# EAGLE board SOC_camera (EAGLE 6.2)
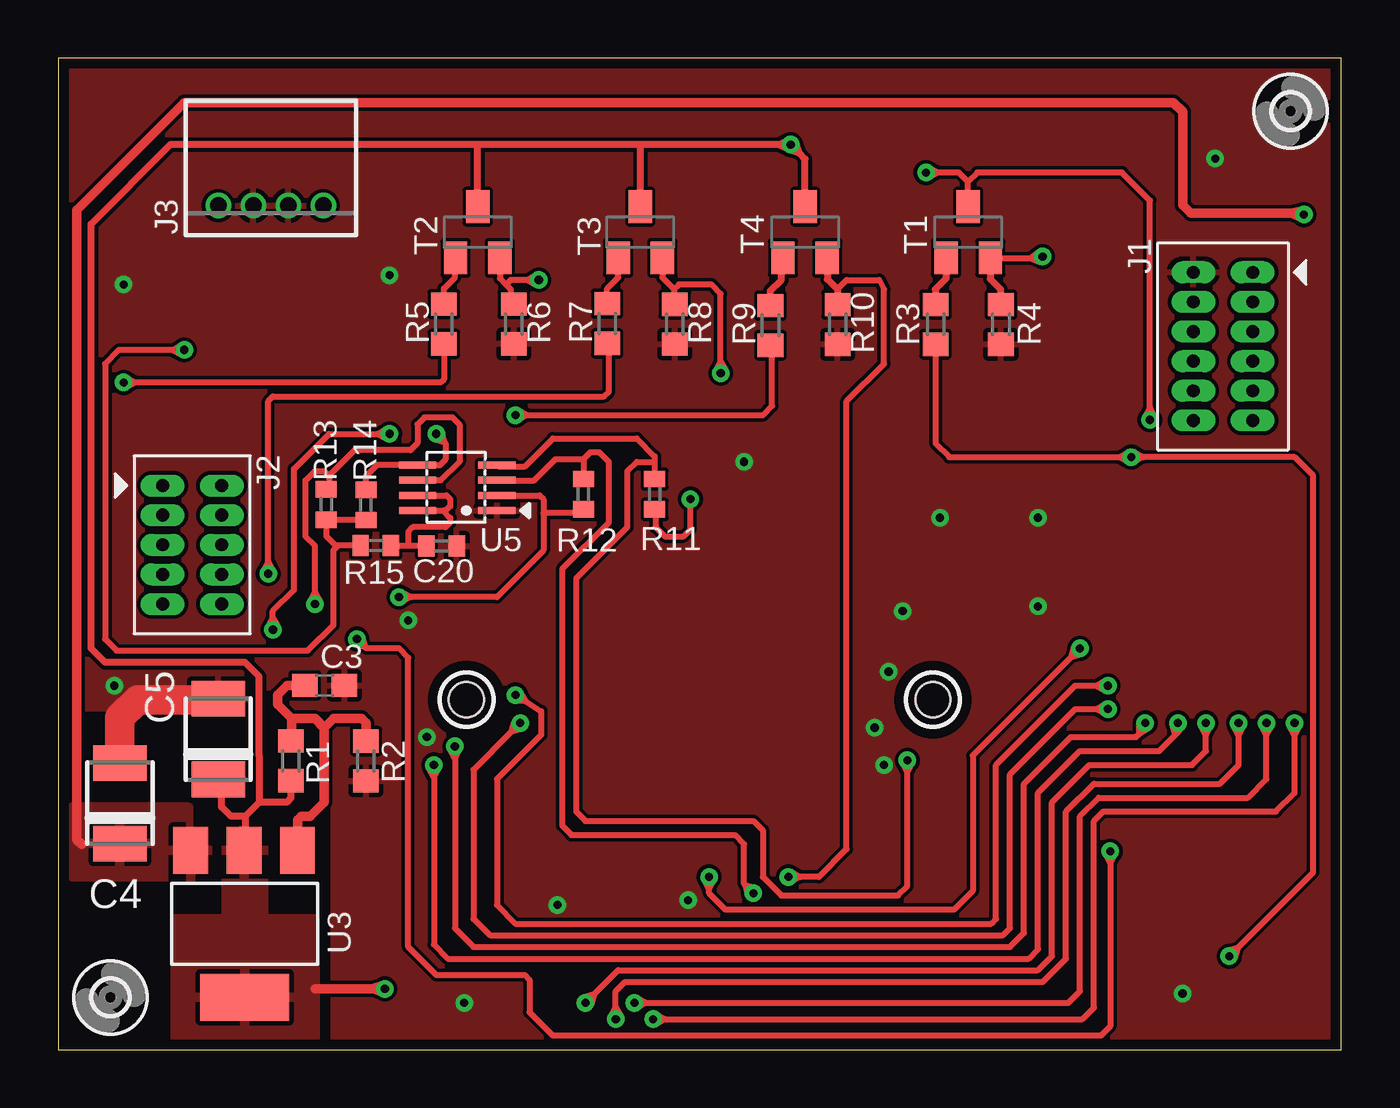
[diagram p4: board, top side]
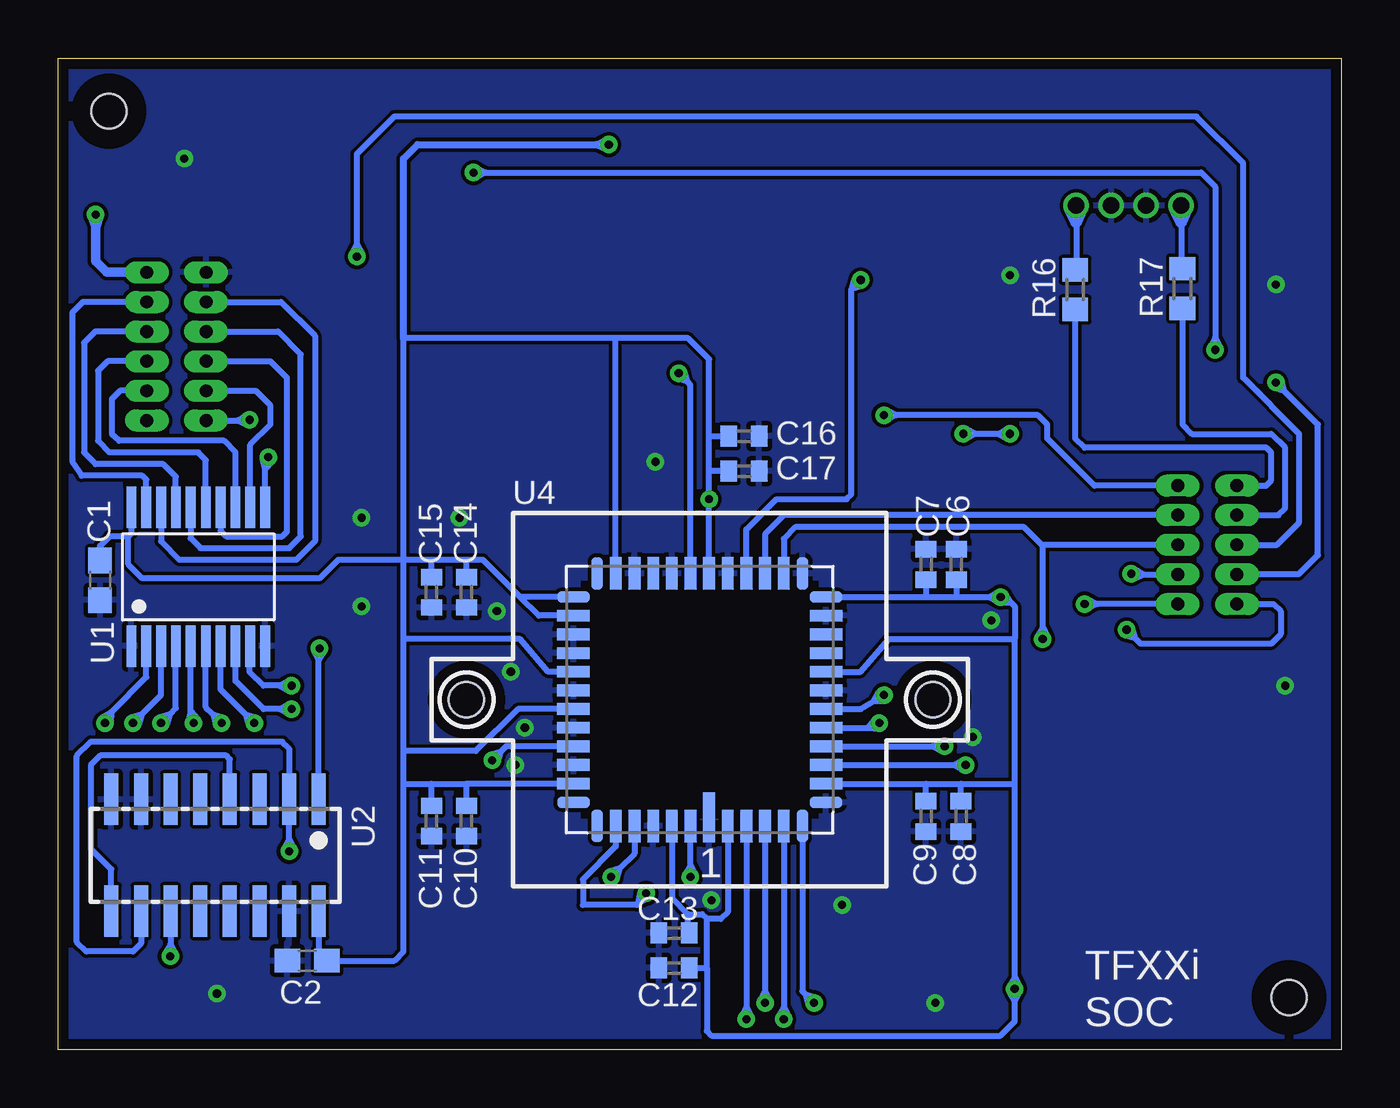
[diagram p5: board, bottom side, seen from below]

Size 55 x 42.5 mm. Coordinates in mm from the lower left corner, seen from the top.
Outline: 0,0 55,0 55,42.5 0,42.5 0,0
Copper layers (1*16): Top 0.018mm / dielectric 1.55mm / Bottom 0.018mm
Design rules: minimum track width 0.15mm, minimum drill 0.25mm, track to track 0.155mm, track to pad 0.155mm, pad to pad 0.155mm, via to via 0.155mm, smd to smd 0.155mm, copper to edge 0.45mm, drill to drill 0.3mm, minimum pad ring 0.2mm, minimum via ring 0.2mm, stop-mask expansion 0.1mm, vias tented up to drill 0mil, thermal gap 0.2mm

## Footprints (pad centres in the part's own frame; a part is rotated, then mirrored left to right if it is on the bottom)
C0603 = smd 1.1 x 1: 1 -0.85,0; 2 0.85,0
3528-21 = smd 1.524 x 2.286: NEG 1.727,0; POS -1.727,0
C0402 = smd 0.7 x 0.9: 1 -0.65,0; 2 0.65,0
1,5 = hole 1.5: 0,0
SOCKET-THD-6X2(1.27X2.54) = drill 0.55 pad 0.762 long: P1 0,0; P2 0,2.54; P3 -1.27,0; P4 -1.27,2.54; P5 -2.54,0; P6 -2.54,2.54; P7 -3.81,0; P8 -3.81,2.54; P9 -5.08,0; P10 -5.08,2.54; P11 -6.35,0; P12 -6.35,2.54
HEADER-THD-5X2(1.27X2.54) = drill 0.55 pad 0.762 long: 1 -5.08,0; 2 -5.08,2.54; 3 -3.81,0; 4 -3.81,2.54; 5 -2.54,0; 6 -2.54,2.54; 7 -1.27,0; 8 -1.27,2.54; 9 0,0; 10 0,2.54
S4B-ZR = drill 0.7 pad 1.1: 1 -2.25,0; 2 -0.75,0; 3 0.75,0; 4 2.25,0
R0603 = smd 1 x 1.1: 1 -0.85,0; 2 0.85,0
R0402 = smd 0.7 x 0.9: 1 -0.65,0; 2 0.65,0
SOT23-BEC = smd 1 x 1.4: B -0.95,-1.1; C 0,1.1; E 0.95,-1.1
TSSOP20 = smd 0.42 x 1.78: 1 -2.865,-2.97; 2 -2.23,-2.97; 3 -1.595,-2.97; 4 -0.96,-2.97; 5 -0.325,-2.97; 6 0.325,-2.97; 7 0.96,-2.97; 8 1.595,-2.97; 9 2.23,-2.97; 10 2.865,-2.97; 11 2.865,2.97; 12 2.23,2.97; 13 1.595,2.97; 14 0.96,2.97; 15 0.325,2.97; 16 -0.325,2.97; 17 -0.96,2.97; 18 -1.595,2.97; 19 -2.23,2.97; 20 -2.865,2.97
SOP16 = smd 0.6 x 2.2: 1 -4.445,-2.4; 2 -3.175,-2.4; 3 -1.905,-2.4; 4 -0.635,-2.4; 5 0.635,-2.4; 6 1.905,-2.4; 7 3.175,-2.4; 8 4.445,-2.4; 9 4.445,2.4; 10 3.175,2.4; 11 1.905,2.4; 12 0.635,2.4; 13 -0.635,2.4; 14 -1.905,2.4; 15 -3.175,2.4; 16 -4.445,2.4
SOT223 = smd 1.499 x 2.007: 1 -2.261,-3.15; 2 0.025,-3.15; 3 2.311,-3.15 | smd 3.81 x 2.007: 4 0,3.15
APTINA = smd 0.5 x 2.15: 1 -0.4,5.04 | smd 0.5 x 1.4: 2 -1.2,5.415; 3 -2,5.415; 4 -2.8,5.415; 5 -3.6,5.415; 6 -4.4,5.415; 19 -4.4,-5.415; 20 -3.6,-5.415; 21 -2.8,-5.415; 22 -2,-5.415; 23 -1.2,-5.415; 24 -0.4,-5.415; 25 0.4,-5.415; 26 1.2,-5.415; 27 2,-5.415; 28 2.8,-5.415; 29 3.6,-5.415; 30 4.4,-5.415; 43 4.4,5.415; 44 3.6,5.415; 45 2.8,5.415; 46 2,5.415; 47 1.2,5.415; 48 0.4,5.415 | smd 1.4 x 0.5: 7 -5.415,4.4; 8 -5.415,3.6; 9 -5.415,2.8; 10 -5.415,2; 11 -5.415,1.2; 12 -5.415,0.4; 13 -5.415,-0.4; 14 -5.415,-1.2; 15 -5.415,-2; 16 -5.415,-2.8; 17 -5.415,-3.6; 18 -5.415,-4.4; 31 5.415,-4.4; 32 5.415,-3.6; 33 5.415,-2.8; 34 5.415,-2; 35 5.415,-1.2; 36 5.415,-0.4; 37 5.415,0.4; 38 5.415,1.2; 39 5.415,2; 40 5.415,2.8; 41 5.415,3.6; 42 5.415,4.4 | hole 1.5: -10,0; 10,0
SSOP8 = smd 0.3 x 1.6: 1 0,0; 2 0.65,0; 3 1.3,0; 4 1.95,0; 5 1.95,3.4; 6 1.3,3.4; 7 0.65,3.4; 8 0,3.4

## Placement (x,y rotation side)
C1  100n  [C0603]  53.21,20.12 270 bottom
C2  100n  [C0603]  44.33,3.81 180 bottom
C3  100n  [C0603]  11.42,15.61 180 top
C4  10uF  [3528-21]  2.64,10.56 90 top
C5  100uF  [3528-21]  6.86,13.31 90 top
C6  100n  [C0402]  16.5,20.8 90 bottom
C7  1u  [C0402]  17.8,20.8 90 bottom
C8  100n  [C0402]  16.3,10 270 bottom
C9  1u  [C0402]  17.8,10 270 bottom
C10  100n  [C0402]  37.5,9.8 270 bottom
C11  1u  [C0402]  39,9.8 270 bottom
C12  100n  [C0402]  28.6,3.5 180 bottom
C13  1u  [C0402]  28.6,5 180 bottom
C14  100n  [C0402]  37.5,19.6 270 bottom
C15  1u  [C0402]  39,19.6 270 bottom
C16  100n  [C0402]  25.6,26.3 0 bottom
C17  1u  [C0402]  25.6,24.8 0 bottom
C20  100n  [C0402]  16.43,21.59 0 top
H1  MOUNT-HOLE1.5  [1,5]  2.24,2.24 0 top
H2  MOUNT-HOLE1.5  [1,5]  52.83,40.23 0 top
J1  SOCKET-6X2-1.25X2-54  [SOCKET-THD-6X2(1.27X2.54)]  51.21,33.32 90 top
J2  HEADER-5X2-1.27-2.54  [HEADER-THD-5X2(1.27X2.54)]  4.47,19.1 270 top
J3  S4B-ZR  [S4B-ZR]  9.11,36.19 180 top
R1  1k  [R0603]  9.97,12.38 270 top
R2  1k27  [R0603]  13.19,12.37 90 top
R3  7k5  [R0603]  37.61,31.09 90 top
R4  1k  [R0603]  40.41,31.09 90 top
R5  7k5  [R0603]  16.53,31.11 90 top
R6  1k  [R0603]  19.53,31.11 90 top
R7  7k5  [R0603]  23.53,31.13 90 top
R8  1k  [R0603]  26.43,31.1 90 top
R9  7k5  [R0603]  30.53,31.05 90 top
R10  1k  [R0603]  33.41,31.09 90 top
R11  1k5  [R0402]  25.57,23.81 270 top
R12  1k5  [R0402]  22.51,23.81 270 top
R13  1k5  [R0402]  11.49,23.37 270 top
R14  1k5  [R0402]  13.19,23.35 270 top
R15  200k  [R0402]  13.61,21.61 180 top
R16  64R9  [R0603]  11.41,32.58 90 bottom
R17  64R9  [R0603]  6.81,32.63 90 bottom
T1  MMBT3904  [SOT23-BEC]  39.01,35.04 0 top
T2  MMBT3904  [SOT23-BEC]  17.98,35.04 0 top
T3  MMBT3904  [SOT23-BEC]  24.95,35.04 0 top
T4  MMBT3904  [SOT23-BEC]  32.02,35.04 0 top
U1  74LCX574  [TSSOP20]  49,20.27 0 bottom
U2  CD74HC4520M  [SOP16]  48.28,8.33 180 bottom
U3  REG1117  [SOT223]  7.99,5.39 180 top
U4  MT9M131  [APTINA]  27.5,15 180 bottom
U5  PCA9306DCT  [SSOP8]  18.8,23.11 90 top

## Tracks (layer width: path | path; a pad name or v marks a point on that pad's centre or on a via)
CMOS_D0  (via drill 0.35)
  Top 0.254: v25.5,1.3 26.02,1.3 | 26.02,1.3 43.9,1.3 44.4,1.8 44.4,9.8 44.8,10.2 52.2,10.2 53,11 53,13.47 | 53,13.47 v53,14 | 26.02,1.3 | 26.02,1.3 25.62,1.52 | 25.62,1.52 | 53,13.47 | 53,13.47 53.22,13.88 | 53.22,13.88 | 26.02,1.3 | 26.02,1.3 25.62,1.52 | v25.5,1.3 25.62,1.52 | 26.02,1.3 | 26.02,1.3 25.62,1.08 | 25.62,1.08 | 26.02,1.3 | 26.02,1.3 25.62,1.08 | v25.5,1.3 25.62,1.08 | 26.02,1.3 25.62,1.08 | 25.62,1.08 | 26.02,1.3 25.62,1.52 | 25.62,1.52 | v25.5,1.3 25.62,1.52 | 26.02,1.3 25.62,1.08 | v25.5,1.3 25.62,1.08 | 26.02,1.3 25.62,1.52 | v25.5,1.3 25.62,1.52 | 26.02,1.3 25.62,1.08 | v25.5,1.3 25.62,1.08 | 53,13.47 | 53,13.47 53.22,13.88 | v53,14 53.22,13.88 | 53,13.47 | 53,13.47 52.78,13.88 | 52.78,13.88 | 53,13.47 | 53,13.47 52.78,13.88 | v53,14 52.78,13.88 | 53,13.47 52.78,13.88 | 52.78,13.88 | 53,13.47 53.22,13.88 | 53.22,13.88 | v53,14 53.22,13.88 | 53,13.47 52.78,13.88 | v53,14 52.78,13.88 | 53,13.47 53.22,13.88 | v53,14 53.22,13.88 | 53,13.47 52.78,13.88 | v53,14 52.78,13.88
  Bottom 0.254: U4.3 25.5,1.82 | 25.5,1.82 v25.5,1.3 | U1.2 51.23,15.97 52.74,14.46 | v53,14 53,14.2 52.74,14.46 | 25.5,1.82 25.28,1.42 | 25.28,1.42 | 25.5,1.82 | 25.5,1.82 25.28,1.42 | v25.5,1.3 25.28,1.42 | 25.5,1.82 | 25.5,1.82 25.72,1.42 | 25.72,1.42 | 25.5,1.82 | 25.5,1.82 25.72,1.42 | v25.5,1.3 25.72,1.42 | 25.5,1.82 25.28,1.42 | 25.28,1.42 | 25.5,1.82 25.28,1.42 | v25.5,1.3 25.28,1.42 | 25.5,1.82 25.72,1.42 | 25.72,1.42 | v25.5,1.3 25.72,1.42 | 25.5,1.82 25.28,1.42 | 25.5,1.82 25.72,1.42 | 25.5,1.82 25.28,1.42 | v25.5,1.3 25.28,1.42 | 25.5,1.82 25.72,1.42 | v25.5,1.3 25.72,1.42 | 52.74,14.46 52.75,13.99 v53,14 | 52.74,14.46 53.13,14.21 v53,14
CMOS_D0_DIV
  Bottom 0.254: J1.P3 53.95,32.05 54.4,31.6 54.4,25.2 54,24.6 51.4,24.6 51.23,24.43 U1.19
CMOS_D1  (via drill 0.35)
  Top 0.254: v24.7,2 25.23,2 | 25.23,2 43.3,2 43.8,2.5 43.8,10 44.6,10.8 51,10.8 51.8,11.6 51.8,13.47 | 51.8,13.47 v51.8,14 | 25.23,2 | 25.23,2 24.82,2.22 | 24.82,2.22 | 51.8,13.47 | 51.8,13.47 52.02,13.88 | 52.02,13.88 | 25.23,2 | 25.23,2 24.82,2.22 | v24.7,2 24.82,2.22 | 25.23,2 | 25.23,2 24.82,1.78 | 24.82,1.78 | 25.23,2 | 25.23,2 24.82,1.78 | v24.7,2 24.82,1.78 | 25.23,2 24.82,1.78 | 24.82,1.78 | 25.23,2 24.82,2.22 | 24.82,2.22 | v24.7,2 24.82,2.22 | 25.23,2 24.82,1.78 | v24.7,2 24.82,1.78 | 25.23,2 24.82,2.22 | v24.7,2 24.82,2.22 | 25.23,2 24.82,1.78 | v24.7,2 24.82,1.78 | 51.8,13.47 | 51.8,13.47 52.02,13.88 | v51.8,14 52.02,13.88 | 51.8,13.47 | 51.8,13.47 51.58,13.88 | 51.58,13.88 | 51.8,13.47 | 51.8,13.47 51.58,13.88 | v51.8,14 51.58,13.88 | 51.8,13.47 51.58,13.88 | 51.58,13.88 | 51.8,13.47 52.02,13.88 | 52.02,13.88 | v51.8,14 52.02,13.88 | 51.8,13.47 51.58,13.88 | v51.8,14 51.58,13.88 | 51.8,13.47 52.02,13.88 | v51.8,14 52.02,13.88 | 51.8,13.47 51.58,13.88 | v51.8,14 51.58,13.88
  Bottom 0.254: U4.4 24.7,2.52 | 24.7,2.52 v24.7,2 | v51.8,14 51.43,14.37 | 51.43,14.37 50.59,15.21 U1.3 | 24.7,2.52 24.48,2.12 | 24.48,2.12 | 24.7,2.52 | 24.7,2.52 24.48,2.12 | v24.7,2 24.48,2.12 | 24.7,2.52 | 24.7,2.52 24.92,2.12 | 24.92,2.12 | 24.7,2.52 | 24.7,2.52 24.92,2.12 | v24.7,2 24.92,2.12 | 24.7,2.52 24.48,2.12 | 24.48,2.12 | 24.7,2.52 24.48,2.12 | v24.7,2 24.48,2.12 | 24.7,2.52 24.92,2.12 | 24.92,2.12 | v24.7,2 24.92,2.12 | 24.7,2.52 24.48,2.12 | 24.7,2.52 24.92,2.12 | 24.7,2.52 24.48,2.12 | v24.7,2 24.48,2.12 | 24.7,2.52 24.92,2.12 | v24.7,2 24.92,2.12 | 51.43,14.37 51.56,13.93 v51.8,14 | 51.43,14.37 51.87,14.24 v51.8,14
CMOS_D1_DIV
  Bottom 0.254: J1.P4 45.45,32.05 44,30.6 44,21.8 44.8,21 49.8,21 50.59,21.8 U1.18
CMOS_D2  (via drill 0.35)
  Top 0.254: v23.9,1.3 23.9,1.82 | 23.9,1.82 23.9,2.5 24.3,2.9 42.2,2.9 43.2,3.9 43.2,10.2 44.4,11.4 49.8,11.4 50.6,12.2 50.6,13.47 | 50.6,13.47 v50.6,14 | 23.9,1.82 23.68,1.42 | 23.68,1.42 | 50.6,13.47 | 50.6,13.47 50.82,13.88 | 50.82,13.88 | 23.9,1.82 | 23.9,1.82 23.68,1.42 | v23.9,1.3 23.68,1.42 | 23.9,1.82 | 23.9,1.82 24.12,1.42 | 24.12,1.42 | 23.9,1.82 | 23.9,1.82 24.12,1.42 | v23.9,1.3 24.12,1.42 | 23.9,1.82 23.68,1.42 | 23.68,1.42 | 23.9,1.82 23.68,1.42 | v23.9,1.3 23.68,1.42 | 23.9,1.82 24.12,1.42 | 24.12,1.42 | v23.9,1.3 24.12,1.42 | 23.9,1.82 23.68,1.42 | 23.9,1.82 24.12,1.42 | 23.9,1.82 23.68,1.42 | v23.9,1.3 23.68,1.42 | 23.9,1.82 24.12,1.42 | v23.9,1.3 24.12,1.42 | 50.6,13.47 | 50.6,13.47 50.82,13.88 | v50.6,14 50.82,13.88 | 50.6,13.47 | 50.6,13.47 50.38,13.88 | 50.38,13.88 | 50.6,13.47 | 50.6,13.47 50.38,13.88 | v50.6,14 50.38,13.88 | 50.6,13.47 50.38,13.88 | 50.38,13.88 | 50.6,13.47 50.82,13.88 | 50.82,13.88 | v50.6,14 50.82,13.88 | 50.6,13.47 50.38,13.88 | v50.6,14 50.38,13.88 | 50.6,13.47 50.82,13.88 | v50.6,14 50.82,13.88 | 50.6,13.47 50.38,13.88 | v50.6,14 50.38,13.88
  Bottom 0.254: U4.5 23.9,1.82 | 23.9,1.82 v23.9,1.3 | v50.6,14 50.23,14.37 | 50.23,14.37 49.96,14.64 U1.4 | 23.9,1.82 23.68,1.42 | 23.68,1.42 | 23.9,1.82 | 23.9,1.82 23.68,1.42 | v23.9,1.3 23.68,1.42 | 23.9,1.82 | 23.9,1.82 24.12,1.42 | 24.12,1.42 | 23.9,1.82 | 23.9,1.82 24.12,1.42 | v23.9,1.3 24.12,1.42 | 23.9,1.82 23.68,1.42 | 23.68,1.42 | 23.9,1.82 23.68,1.42 | v23.9,1.3 23.68,1.42 | 23.9,1.82 24.12,1.42 | 24.12,1.42 | v23.9,1.3 24.12,1.42 | 23.9,1.82 23.68,1.42 | 23.9,1.82 24.12,1.42 | 23.9,1.82 23.68,1.42 | v23.9,1.3 23.68,1.42 | 23.9,1.82 24.12,1.42 | v23.9,1.3 24.12,1.42 | 50.23,14.37 50.36,13.93 v50.6,14 | 50.23,14.37 50.67,14.24 v50.6,14
CMOS_D2_DIV
  Bottom 0.254: J1.P5 53.41,30.79 53.9,30.3 53.9,25.6 53.4,25.1 50.5,25.1 49.96,24.56 U1.17
CMOS_D3  (via drill 0.35)
  Top 0.254: v22.6,2 22.97,2.37 | 22.97,2.37 24,3.4 42,3.4 42.6,4 42.6,10.6 44.2,12.2 48.6,12.2 49.2,12.8 49.2,13.47 | 49.2,13.47 v49.2,14 | 49.2,13.47 | 49.2,13.47 49.42,13.88 | 49.42,13.88 | 22.97,2.37 22.53,2.24 v22.6,2 | 22.97,2.37 22.84,1.93 v22.6,2 | 49.2,13.47 | 49.2,13.47 49.42,13.88 | v49.2,14 49.42,13.88 | 49.2,13.47 | 49.2,13.47 48.98,13.88 | 48.98,13.88 | 49.2,13.47 | 49.2,13.47 48.98,13.88 | v49.2,14 48.98,13.88 | 49.2,13.47 48.98,13.88 | 48.98,13.88 | 49.2,13.47 49.42,13.88 | 49.42,13.88 | v49.2,14 49.42,13.88 | 49.2,13.47 48.98,13.88 | v49.2,14 48.98,13.88 | 49.2,13.47 49.42,13.88 | v49.2,14 49.42,13.88 | 49.2,13.47 48.98,13.88 | v49.2,14 48.98,13.88
  Bottom 0.254: U4.6 23.1,2.5 22.97,2.37 | 22.97,2.37 v22.6,2 | v49.2,14 49.33,14.12 49.33,14.51 | 49.33,14.51 U1.5 | 22.97,2.37 22.53,2.24 v22.6,2 | 22.97,2.37 22.84,1.93 v22.6,2 | 49.33,14.51 49.02,14.17 v49.2,14 | 49.33,14.51 49.44,14.06 v49.2,14
CMOS_D3_DIV
  Bottom 0.254: U1.16 49.33,21.93 48.9,21.5 45.1,21.5 44.6,22 44.6,29.8 45.59,30.79 J1.P6
CMOS_D4  (via drill 0.35)
  Top 0.254: v16.1,12.2 16.1,11.68 | 16.1,11.68 16.1,4.5 16.7,3.9 41.6,3.9 42,4.3 42,11 43.8,12.8 47.2,12.8 47.89,13.49 | 47.89,13.49 48,13.6 v48,14 | 16.1,11.68 | 16.1,11.68 16.32,12.08 | 16.32,12.08 | 16.1,11.68 | 16.1,11.68 16.32,12.08 | v16.1,12.2 16.32,12.08 | 16.1,11.68 | 16.1,11.68 15.88,12.08 | 15.88,12.08 | 16.1,11.68 | 16.1,11.68 15.88,12.08 | v16.1,12.2 15.88,12.08 | 16.1,11.68 15.88,12.08 | 15.88,12.08 | 16.1,11.68 16.32,12.08 | 16.32,12.08 | v16.1,12.2 16.32,12.08 | 16.1,11.68 15.88,12.08 | v16.1,12.2 15.88,12.08 | 16.1,11.68 16.32,12.08 | v16.1,12.2 16.32,12.08 | 16.1,11.68 15.88,12.08 | v16.1,12.2 15.88,12.08 | 47.89,13.49 48.19,13.84 v48,14 | 47.89,13.49 47.76,13.93 v48,14
  Bottom 0.254: U4.9 16.62,12.2 | 16.62,12.2 v16.1,12.2 | v48,14 48.37,14.37 | 48.37,14.37 48.67,14.68 U1.6 | 16.62,12.2 | 16.62,12.2 16.22,12.42 | 16.22,12.42 | 16.62,12.2 | 16.62,12.2 16.22,12.42 | v16.1,12.2 16.22,12.42 | 16.62,12.2 | 16.62,12.2 16.22,11.98 | 16.22,11.98 | 16.62,12.2 | 16.62,12.2 16.22,11.98 | v16.1,12.2 16.22,11.98 | 16.62,12.2 16.22,11.98 | 16.22,11.98 | 16.62,12.2 16.22,12.42 | 16.22,12.42 | v16.1,12.2 16.22,12.42 | 16.62,12.2 16.22,11.98 | v16.1,12.2 16.22,11.98 | 16.62,12.2 16.22,12.42 | v16.1,12.2 16.22,12.42 | 16.62,12.2 16.22,11.98 | v16.1,12.2 16.22,11.98 | 48.37,14.37 47.93,14.24 v48,14 | 48.37,14.37 48.24,13.93 v48,14
CMOS_D4_DIV
  Bottom 0.254: J1.P7 52.88,29.52 53.3,29.1 53.3,26.1 52.8,25.6 49,25.6 48.67,25.27 U1.15
CMOS_D5  (via drill 0.35)
  Top 0.254: v17,13 17,12.47 | 17,12.47 17,5.2 17.8,4.4 40.8,4.4 41.4,5 41.4,11.4 43.4,13.4 46.2,13.4 46.34,13.54 | 46.34,13.54 46.6,13.8 v46.6,14 | 17,12.47 | 17,12.47 17.22,12.88 | 17.22,12.88 | 17,12.47 | 17,12.47 17.22,12.88 | v17,13 17.22,12.88 | 17,12.47 | 17,12.47 16.78,12.88 | 16.78,12.88 | 17,12.47 | 17,12.47 16.78,12.88 | v17,13 16.78,12.88 | 17,12.47 16.78,12.88 | 16.78,12.88 | 17,12.47 17.22,12.88 | 17.22,12.88 | v17,13 17.22,12.88 | 17,12.47 16.78,12.88 | v17,13 16.78,12.88 | 17,12.47 17.22,12.88 | v17,13 17.22,12.88 | 17,12.47 16.78,12.88 | v17,13 16.78,12.88 | 46.34,13.54 46.73,13.79 v46.6,14 | 46.34,13.54 46.35,14.01 v46.6,14
  Bottom 0.254: U4.10 17.52,13 | 17.52,13 v17,13 | v46.6,14 46.97,14.37 | 46.97,14.37 48.04,15.44 U1.7 | 17.52,13 | 17.52,13 17.12,13.22 | 17.12,13.22 | 17.52,13 | 17.52,13 17.12,13.22 | v17,13 17.12,13.22 | 17.52,13 | 17.52,13 17.12,12.78 | 17.12,12.78 | 17.52,13 | 17.52,13 17.12,12.78 | v17,13 17.12,12.78 | 17.52,13 17.12,12.78 | 17.12,12.78 | 17.52,13 17.12,13.22 | 17.12,13.22 | v17,13 17.12,13.22 | 17.52,13 17.12,12.78 | v17,13 17.12,12.78 | 17.52,13 17.12,13.22 | v17,13 17.12,13.22 | 17.52,13 17.12,12.78 | v17,13 17.12,12.78 | 46.97,14.37 46.53,14.24 v46.6,14 | 46.97,14.37 46.84,13.93 v46.6,14
CMOS_D5_DIV
  Bottom 0.254: J1.P8 45.91,29.52 45.2,28.8 45.2,22.2 45.4,22 47.8,22 48.04,22.24 U1.14
CMOS_D6  (via drill 0.35)
  Top 0.254: v19.8,14 19.43,13.63 | 19.43,13.63 17.8,12 17.8,5.6 18.5,4.9 40.5,4.9 40.8,5.2 40.8,11.8 43.6,14.6 44.48,14.6 | 44.48,14.6 v45,14.6 | 44.48,14.6 44.88,14.38 | 44.88,14.38 | 19.43,13.63 19.87,13.76 v19.8,14 | 19.43,13.63 19.56,14.07 v19.8,14 | 44.48,14.6 | 44.48,14.6 44.88,14.38 | v45,14.6 44.88,14.38 | 44.48,14.6 | 44.48,14.6 44.88,14.82 | 44.88,14.82 | 44.48,14.6 | 44.48,14.6 44.88,14.82 | v45,14.6 44.88,14.82 | 44.48,14.6 44.88,14.38 | 44.88,14.38 | 44.48,14.6 44.88,14.38 | v45,14.6 44.88,14.38 | 44.48,14.6 44.88,14.82 | 44.88,14.82 | v45,14.6 44.88,14.82 | 44.48,14.6 44.88,14.38 | 44.48,14.6 44.88,14.82 | 44.48,14.6 44.88,14.38 | v45,14.6 44.88,14.38 | 44.48,14.6 44.88,14.82 | v45,14.6 44.88,14.82
  Bottom 0.254: U4.11 20.29,13.8 | 20.29,13.8 20,13.8 v19.8,14 | v45,14.6 45.52,14.6 | 45.52,14.6 46.2,14.6 47.4,15.8 U1.8 | 45.52,14.6 | 45.52,14.6 45.12,14.82 | 45.12,14.82 | 20.29,13.8 19.99,14.16 v19.8,14 | 20.29,13.8 19.82,13.75 v19.8,14 | 45.52,14.6 | 45.52,14.6 45.12,14.82 | v45,14.6 45.12,14.82 | 45.52,14.6 | 45.52,14.6 45.12,14.38 | 45.12,14.38 | 45.52,14.6 | 45.52,14.6 45.12,14.38 | v45,14.6 45.12,14.38 | 45.52,14.6 45.12,14.38 | 45.12,14.38 | 45.52,14.6 45.12,14.82 | 45.12,14.82 | v45,14.6 45.12,14.82 | 45.52,14.6 45.12,14.38 | v45,14.6 45.12,14.38 | 45.52,14.6 45.12,14.82 | v45,14.6 45.12,14.82 | 45.52,14.6 45.12,14.38 | v45,14.6 45.12,14.38
CMOS_D6_DIV
  Bottom 0.254: U1.13 47.41,25.61 47.9,26.1 52.4,26.1 52.7,26.4 52.7,27.9 52.35,28.25 J1.P9
CMOS_D7  (via drill 0.35)
  Top 0.254: v19.6,15.2 20.04,14.92 | 20.04,14.92 20.7,14.5 20.7,13.5 18.8,11.6 18.8,6.2 19.6,5.4 40,5.4 40.2,5.6 40.2,12.2 43.6,15.6 44.48,15.6 | 44.48,15.6 v45,15.6 | 20.04,14.92 | 20.04,14.92 19.82,15.32 | 19.82,15.32 | 20.04,14.92 | 20.04,14.92 19.58,14.95 | v19.6,15.2 19.58,14.95 | 20.04,14.92 | 20.04,14.92 19.82,15.32 | 20.04,14.92 19.58,14.95 | 19.82,15.32 | v19.6,15.2 19.82,15.32 | 44.48,15.6 44.88,15.38 | 44.88,15.38 | 20.05,14.93 19.81,15.33 | v19.6,15.2 19.81,15.33 | 20.05,14.93 19.81,15.33 | v19.6,15.2 19.81,15.33 | 20.05,14.93 19.59,14.95 v19.6,15.2 | 20.04,14.92 19.82,15.32 | v19.6,15.2 19.82,15.32 | 20.04,14.92 19.58,14.95 | v19.6,15.2 19.58,14.95 | 44.48,15.6 | 44.48,15.6 44.88,15.38 | v45,15.6 44.88,15.38 | 44.48,15.6 | 44.48,15.6 44.88,15.82 | 44.88,15.82 | 44.48,15.6 | 44.48,15.6 44.88,15.82 | v45,15.6 44.88,15.82 | 44.48,15.6 44.88,15.38 | 44.88,15.38 | 44.48,15.6 44.88,15.38 | v45,15.6 44.88,15.38 | 44.48,15.6 44.88,15.82 | 44.88,15.82 | v45,15.6 44.88,15.82 | 44.48,15.6 44.88,15.38 | 44.48,15.6 44.88,15.82 | 44.48,15.6 44.88,15.38 | v45,15.6 44.88,15.38 | 44.48,15.6 44.88,15.82 | v45,15.6 44.88,15.82
  Bottom 0.254: U4.12 20.6,14.6 v19.6,15.2 | v45,15.6 45.52,15.6 | 45.52,15.6 46.2,15.6 46.8,16.2 46.8,17.27 U1.9 | 45.52,15.6 | 45.52,15.6 45.12,15.82 | 45.12,15.82 | 20.05,14.93 19.81,15.33 | v19.6,15.2 19.81,15.33 | 20.05,14.93 19.81,15.33 | v19.6,15.2 19.81,15.33 | 20.05,14.93 19.59,14.95 v19.6,15.2 | 45.52,15.6 | 45.52,15.6 45.12,15.82 | v45,15.6 45.12,15.82 | 45.52,15.6 | 45.52,15.6 45.12,15.38 | 45.12,15.38 | 45.52,15.6 | 45.52,15.6 45.12,15.38 | v45,15.6 45.12,15.38 | 45.52,15.6 45.12,15.38 | 45.12,15.38 | 45.52,15.6 45.12,15.82 | 45.12,15.82 | v45,15.6 45.12,15.82 | 45.52,15.6 45.12,15.38 | v45,15.6 45.12,15.38 | 45.52,15.6 45.12,15.82 | v45,15.6 45.12,15.82 | 45.52,15.6 45.12,15.38 | v45,15.6 45.12,15.38
CMOS_D7_DIV
  Bottom 0.254: J1.P10 46.55,28.25 45.9,27.6 45.9,26.8 46.77,25.93 U1.12
CMOS_EXTCLK  (via drill 0.35)
  Top 0.254: v19.6,27.2 20.12,27.2 | 20.12,27.2 30.2,27.2 30.6,27.6 30.6,30.13 R9.1 | 20.12,27.2 | 20.12,27.2 19.72,27.42 | 19.72,27.42 | 20.12,27.2 | 20.12,27.2 19.72,27.42 | v19.6,27.2 19.72,27.42 | 20.12,27.2 | 20.12,27.2 19.72,26.98 | 19.72,26.98 | 20.12,27.2 | 20.12,27.2 19.72,26.98 | v19.6,27.2 19.72,26.98 | 20.12,27.2 19.72,26.98 | 19.72,26.98 | 20.12,27.2 19.72,27.42 | 19.72,27.42 | v19.6,27.2 19.72,27.42 | 20.12,27.2 19.72,26.98 | v19.6,27.2 19.72,26.98 | 20.12,27.2 19.72,27.42 | v19.6,27.2 19.72,27.42 | 20.12,27.2 19.72,26.98 | v19.6,27.2 19.72,26.98
  Bottom 0.254: J2.2 10.58,24.18 12.6,26.2 12.6,26.8 13,27.2 19.07,27.2 | 19.07,27.2 v19.6,27.2 | 19.07,27.2 19.48,26.98 | 19.48,26.98 | 19.07,27.2 | 19.07,27.2 19.48,26.98 | v19.6,27.2 19.48,26.98 | 19.07,27.2 | 19.07,27.2 19.48,27.42 | 19.48,27.42 | 19.07,27.2 | 19.07,27.2 19.48,27.42 | v19.6,27.2 19.48,27.42 | 19.07,27.2 19.48,26.98 | 19.48,26.98 | 19.07,27.2 19.48,26.98 | v19.6,27.2 19.48,26.98 | 19.07,27.2 19.48,27.42 | 19.48,27.42 | v19.6,27.2 19.48,27.42 | 19.07,27.2 19.48,26.98 | 19.07,27.2 19.48,27.42 | 19.07,27.2 19.48,26.98 | v19.6,27.2 19.48,26.98 | 19.07,27.2 19.48,27.42 | v19.6,27.2 19.48,27.42
CMOS_EXTCLK_3  (via drill 0.35)
  Top 0.254: 33.4,32.6 33.8,33 35.2,33 35.4,32.6 35.4,29.4 33.8,27.8 33.8,8.6 32.6,7.4 31.82,7.4 | 31.82,7.4 v31.3,7.4 | 31.82,7.4 | 31.82,7.4 31.42,7.62 | 31.42,7.62 | 31.82,7.4 | 31.82,7.4 31.42,7.62 | v31.3,7.4 31.42,7.62 | 31.82,7.4 | 31.82,7.4 31.42,7.18 | 31.42,7.18 | 31.82,7.4 | 31.82,7.4 31.42,7.18 | v31.3,7.4 31.42,7.18 | 31.82,7.4 31.42,7.18 | 31.42,7.18 | 31.82,7.4 31.42,7.62 | 31.42,7.62 | v31.3,7.4 31.42,7.62 | 31.82,7.4 31.42,7.18 | v31.3,7.4 31.42,7.18 | 31.82,7.4 31.42,7.62 | v31.3,7.4 31.42,7.62 | 31.82,7.4 31.42,7.18 | v31.3,7.4 31.42,7.18
  Top 0.305: T4.E 32.97,33.03 33.4,32.6 R10.2
  Bottom 0.254: U4.45 30.3,8.4 30.93,7.77 | 30.93,7.77 v31.3,7.4 | 30.93,7.77 31.06,7.33 v31.3,7.4 | 30.93,7.77 31.37,7.64 v31.3,7.4
CMOS_FV
  Bottom 0.254: J2.4 23.89,22.91 24.7,22.1 U4.21
CMOS_LV  (via drill 0.35)
  Top 0.254: v45.1,8.5 45.1,7.97 | 45.1,7.97 45.1,1 44.7,0.6 21.2,0.6 20.2,1.6 20.2,3 20,3.2 16.2,3.2 15,4.4 15,16.8 14.6,17.2 13.2,17.2 13.17,17.23 | 13.17,17.23 v12.8,17.6 | 45.1,7.97 | 45.1,7.97 45.32,8.38 | 45.32,8.38 | 45.1,7.97 | 45.1,7.97 45.32,8.38 | v45.1,8.5 45.32,8.38 | 45.1,7.97 | 45.1,7.97 44.88,8.38 | 44.88,8.38 | 45.1,7.97 | 45.1,7.97 44.88,8.38 | v45.1,8.5 44.88,8.38 | 45.1,7.97 44.88,8.38 | 44.88,8.38 | 45.1,7.97 45.32,8.38 | 45.32,8.38 | v45.1,8.5 45.32,8.38 | 45.1,7.97 44.88,8.38 | v45.1,8.5 44.88,8.38 | 45.1,7.97 45.32,8.38 | v45.1,8.5 45.32,8.38 | 45.1,7.97 44.88,8.38 | v45.1,8.5 44.88,8.38 | 13.17,17.23 13.04,17.67 v12.8,17.6 | 13.17,17.23 12.73,17.36 v12.8,17.6
  Bottom 0.254: U4.20 23.9,21.9 23.4,22.4 13.6,22.4 12.84,21.64 | U2.10 51.45,4.54 51.8,4.2 53.8,4.2 54.2,4.6 54.2,12.6 53.6,13.2 45.4,13.2 45.1,12.9 U2.2 45.1,9.03 | J2.6 12.84,21.64 | v45.1,8.5 v45.1,8.51 45.1,9.03 | v12.8,17.6 12.8,18.12 | 12.8,18.12 12.8,21.6 12.84,21.64 | 12.8,18.12 12.58,17.72 | 12.58,17.72 | 45.1,9.03 44.88,8.62 v45.1,8.5 | 45.1,9.03 45.32,8.62 v45.1,8.5 | 12.8,18.12 | 12.8,18.12 12.58,17.72 | v12.8,17.6 12.58,17.72 | 12.8,18.12 | 12.8,18.12 13.02,17.72 | 13.02,17.72 | 12.8,18.12 | 12.8,18.12 13.02,17.72 | v12.8,17.6 13.02,17.72 | 12.8,18.12 12.58,17.72 | 12.58,17.72 | 12.8,18.12 12.58,17.72 | v12.8,17.6 12.58,17.72 | 12.8,18.12 13.02,17.72 | 13.02,17.72 | v12.8,17.6 13.02,17.72 | 12.8,18.12 12.58,17.72 | 12.8,18.12 13.02,17.72 | 12.8,18.12 12.58,17.72 | v12.8,17.6 12.58,17.72 | 12.8,18.12 13.02,17.72 | v12.8,17.6 13.02,17.72
CMOS_PIXCLK  (via drill 0.35)
  Top 0.254: v43.8,17.2 43.43,16.83 | 43.43,16.83 39.2,12.6 39.2,6.8 38.4,6 28.6,6 27.9,6.7 27.9,6.88 | 27.9,6.88 v27.9,7.4 | 27.9,6.88 | 27.9,6.88 28.12,7.28 | 28.12,7.28 | 43.43,16.83 43.87,16.96 v43.8,17.2 | 43.43,16.83 43.56,17.27 v43.8,17.2 | 27.9,6.88 | 27.9,6.88 28.12,7.28 | v27.9,7.4 28.12,7.28 | 27.9,6.88 | 27.9,6.88 27.68,7.28 | 27.68,7.28 | 27.9,6.88 | 27.9,6.88 27.68,7.28 | v27.9,7.4 27.68,7.28 | 27.9,6.88 27.68,7.28 | 27.68,7.28 | 27.9,6.88 28.12,7.28 | 28.12,7.28 | v27.9,7.4 28.12,7.28 | 27.9,6.88 27.68,7.28 | v27.9,7.4 27.68,7.28 | 27.9,6.88 28.12,7.28 | v27.9,7.4 28.12,7.28 | 27.9,6.88 27.68,7.28 | v27.9,7.4 27.68,7.28
  Bottom 0.254: U2.1 43.84,16.68 | 43.84,16.68 43.84,17.16 v43.8,17.2 | v27.9,7.4 27.9,7.92 | 27.9,7.92 U4.48 | 27.9,7.92 27.68,7.52 | 27.68,7.52 | 43.84,16.68 44.03,17.1 v43.8,17.2 | 43.84,16.68 43.59,17.07 v43.8,17.2 | 27.9,7.92 | 27.9,7.92 27.68,7.52 | v27.9,7.4 27.68,7.52 | 27.9,7.92 | 27.9,7.92 28.12,7.52 | 28.12,7.52 | 27.9,7.92 | 27.9,7.92 28.12,7.52 | v27.9,7.4 28.12,7.52 | 27.9,7.92 27.68,7.52 | 27.68,7.52 | 27.9,7.92 27.68,7.52 | v27.9,7.4 27.68,7.52 | 27.9,7.92 28.12,7.52 | 28.12,7.52 | v27.9,7.4 28.12,7.52 | 27.9,7.92 27.68,7.52 | 27.9,7.92 28.12,7.52 | 27.9,7.92 27.68,7.52 | v27.9,7.4 27.68,7.52 | 27.9,7.92 28.12,7.52 | v27.9,7.4 28.12,7.52
CMOS_PIXCLK_DIV  (via drill 0.35)
  Top 0.254: T1.E 41.68,33.94 | 41.68,33.94 42.14,33.94 v42.2,34 | 41.68,33.94 42.11,33.77 v42.2,34 | 41.68,33.94 42.06,34.2 v42.2,34
  Top 0.305: T1.E 39.96,33.04 40.4,32.6 R4.2
  Bottom 0.254: J2.5 2.76,21.64 1.8,22.6 1.8,26.4 4.2,28.8 4.2,38 6.2,40 40.6,40 42.2,38.4 42.2,34.52 | 42.2,34.52 v42.2,34 | 42.2,34.52 41.98,34.12 | 41.98,34.12 | 42.2,34.52 | 42.2,34.52 41.98,34.12 | v42.2,34 41.98,34.12 | 42.2,34.52 | 42.2,34.52 42.42,34.12 | 42.42,34.12 | 42.2,34.52 | 42.2,34.52 42.42,34.12 | v42.2,34 42.42,34.12 | 42.2,34.52 41.98,34.12 | 41.98,34.12 | 42.2,34.52 41.98,34.12 | v42.2,34 41.98,34.12 | 42.2,34.52 42.42,34.12 | 42.42,34.12 | v42.2,34 42.42,34.12 | 42.2,34.52 41.98,34.12 | 42.2,34.52 42.42,34.12 | 42.2,34.52 41.98,34.12 | v42.2,34 41.98,34.12 | 42.2,34.52 42.42,34.12 | v42.2,34 42.42,34.12
CMOS_RESET  (via drill 0.35)
  Top 0.254: 16.6,30.19 R5.1 16.53,28.73 16.4,28.6 3.33,28.6 | 3.33,28.6 v2.8,28.6 | 3.33,28.6 | 3.33,28.6 2.92,28.82 | 2.92,28.82 | 3.33,28.6 | 3.33,28.6 2.92,28.82 | v2.8,28.6 2.92,28.82 | 3.33,28.6 | 3.33,28.6 2.92,28.38 | 2.92,28.38 | 3.33,28.6 | 3.33,28.6 2.92,28.38 | v2.8,28.6 2.92,28.38 | 3.33,28.6 2.92,28.38 | 2.92,28.38 | 3.33,28.6 2.92,28.82 | 2.92,28.82 | v2.8,28.6 2.92,28.82 | 3.33,28.6 2.92,28.38 | v2.8,28.6 2.92,28.38 | 3.33,28.6 2.92,28.82 | v2.8,28.6 2.92,28.82 | 3.33,28.6 2.92,28.38 | v2.8,28.6 2.92,28.38
  Bottom 0.254: 2.43,28.23 1,26.8 1,21.2 1.83,20.37 J2.7 | 2.43,28.23 v2.8,28.6 | 2.43,28.23 2.87,28.36 v2.8,28.6 | 2.43,28.23 2.56,28.67 v2.8,28.6
CMOS_RESET_3  (via drill 0.35)
  Top 0.254: T2.E 18.93,33.07 19.2,32.8 | 19.2,32.8 19.4,32.6 19.4,32.09 R6.2 | v20.6,33 20.07,33 | 20.07,33 19.4,33 19.2,32.8 | 20.07,33 20.48,32.78 | 20.48,32.78 | 20.07,33 | 20.07,33 20.48,32.78 | v20.6,33 20.48,32.78 | 20.07,33 | 20.07,33 20.48,33.22 | 20.48,33.22 | 20.07,33 | 20.07,33 20.48,33.22 | v20.6,33 20.48,33.22 | 20.07,33 20.48,32.78 | 20.48,32.78 | 20.07,33 20.48,32.78 | v20.6,33 20.48,32.78 | 20.07,33 20.48,33.22 | 20.48,33.22 | v20.6,33 20.48,33.22 | 20.07,33 20.48,32.78 | 20.07,33 20.48,33.22 | 20.07,33 20.48,32.78 | v20.6,33 20.48,32.78 | 20.07,33 20.48,33.22 | v20.6,33 20.48,33.22
  Bottom 0.254: U4.22 25.5,22.3 24.2,23.6 21.2,23.6 21,23.8 21,32.6 20.97,32.63 | 20.97,32.63 v20.6,33 | 20.97,32.63 20.84,33.07 v20.6,33 | 20.97,32.63 20.53,32.76 v20.6,33
CMOS_SCLK  (via drill 0.35)
  Top 0.254: v29.8,6.7 29.43,7.07 | 29.43,7.07 29.4,7.1 29.4,8.8 29,9.2 22,9.2 21.6,9.6 21.6,20.6 23.6,22.6 23.6,25.2 23.2,25.6 22.8,25.6 22.51,25.31 | 29.43,7.07 29.56,6.63 v29.8,6.7 | 29.43,7.07 29.87,6.94 v29.8,6.7 | 22.51,25.31 R12.1 | U5.3 20.4,24.4 21.31,25.31 22.51,25.31
  Bottom 0.254: U4.44 31.1,8.7 32.51,7.29 32.51,6.2 30.2,6.2 30.12,6.28 | 30.12,6.28 29.8,6.6 v29.8,6.7 | 30.12,6.28 30.05,6.74 v29.8,6.7 | 30.12,6.28 29.7,6.47 v29.8,6.7
CMOS_SDATA  (via drill 0.35)
  Top 0.254: 36.4,8.12 36.4,11.88 | 36.4,11.88 v36.4,12.4 | 36.4,7.08 36.4,7 36,6.6 31,6.6 30.2,7.4 30.2,9.4 29.8,9.8 22.6,9.8 22.2,10.2 22.2,20.2 24.4,22.4 24.4,24.8 24.8,25.2 25.57,25.2 | 36.4,7.08 | 36.4,11.88 | 36.4,11.88 36.62,12.28 | 36.62,12.28 | 36.4,8.12 | 36.4,8.12 | 36.4,8.12 | 36.4,7.08 | 36.4,7.08 | 36.4,7.08 | 36.4,11.88 | 36.4,11.88 36.62,12.28 | v36.4,12.4 36.62,12.28 | 36.4,11.88 | 36.4,11.88 36.18,12.28 | 36.18,12.28 | 36.4,11.88 | 36.4,11.88 36.18,12.28 | v36.4,12.4 36.18,12.28 | 36.4,11.88 36.18,12.28 | 36.18,12.28 | 36.4,11.88 36.62,12.28 | 36.62,12.28 | v36.4,12.4 36.62,12.28 | 36.4,11.88 36.18,12.28 | v36.4,12.4 36.18,12.28 | 36.4,11.88 36.62,12.28 | v36.4,12.4 36.62,12.28 | 36.4,11.88 36.18,12.28 | v36.4,12.4 36.18,12.28 | U5.4 18.86,25 20,25 21.2,26.2 24.8,26.2 25.57,25.43 25.57,25.2 | 25.57,25.2 R11.1 | 36.4,7.08 | 36.4,7.08 36.4,8.12
  Bottom 0.254: U4.39 35.8,13 36.03,12.77 | 36.03,12.77 v36.4,12.4 | 36.03,12.77 36.16,12.33 v36.4,12.4 | 36.03,12.77 36.47,12.64 v36.4,12.4
CMOS_STBY  (via drill 0.35)
  Top 0.254: v9,20.4 9,20.93 | 9,20.93 9,27.8 9.2,28 23.4,28 23.6,28.2 23.6,30.21 R7.1 | 9,20.93 8.78,20.52 | 8.78,20.52 | 9,20.93 | 9,20.93 8.78,20.52 | v9,20.4 8.78,20.52 | 9,20.93 | 9,20.93 9.22,20.52 | 9.22,20.52 | 9,20.93 | 9,20.93 9.22,20.52 | v9,20.4 9.22,20.52 | 9,20.93 8.78,20.52 | 8.78,20.52 | 9,20.93 8.78,20.52 | v9,20.4 8.78,20.52 | 9,20.93 9.22,20.52 | 9.22,20.52 | v9,20.4 9.22,20.52 | 9,20.93 8.78,20.52 | 9,20.93 9.22,20.52 | 9,20.93 8.78,20.52 | v9,20.4 8.78,20.52 | 9,20.93 9.22,20.52 | v9,20.4 9.22,20.52
  Bottom 0.254: 8.48,20.37 8.97,20.37 v9,20.4 | 8.48,20.37 8.89,20.18 v9,20.4 | 8.48,20.37 8.87,20.61 v9,20.4 | 8.48,20.37 J2.8
CMOS_STBY_3  (via drill 0.35)
  Top 0.254: T3.E 25.9,33.1 26.4,32.6 | 26.4,32.6 26.4,31.98 R8.2 | v28.4,29 28.4,29.52 | 28.4,29.52 28.4,32.4 28,32.8 26.6,32.8 26.4,32.6 | 28.4,29.52 28.18,29.12 | 28.18,29.12 | 28.4,29.52 | 28.4,29.52 28.18,29.12 | v28.4,29 28.18,29.12 | 28.4,29.52 | 28.4,29.52 28.62,29.12 | 28.62,29.12 | 28.4,29.52 | 28.4,29.52 28.62,29.12 | v28.4,29 28.62,29.12 | 28.4,29.52 28.18,29.12 | 28.18,29.12 | 28.4,29.52 28.18,29.12 | v28.4,29 28.18,29.12 | 28.4,29.52 28.62,29.12 | 28.62,29.12 | v28.4,29 28.62,29.12 | 28.4,29.52 28.18,29.12 | 28.4,29.52 28.62,29.12 | 28.4,29.52 28.18,29.12 | v28.4,29 28.18,29.12 | 28.4,29.52 28.62,29.12 | v28.4,29 28.62,29.12
  Bottom 0.254: U4.25 27.9,28.5 28.03,28.63 | 28.03,28.63 v28.4,29 | 28.03,28.63 28.47,28.76 v28.4,29 | 28.03,28.63 28.16,29.07 v28.4,29
CMOS_TWCK  (via drill 0.35)
  Top 0.254: 11.6,24.6 11.4,24.8 11,24.8 10.6,24.4 10.6,22 11,21.6 11,19.62 | 11.6,24.6 11.6,24.13 R13.1 | U5.6 16.41,24.41 17.2,25.2 17.2,26.8 16.9,27.1 15.7,27.1 15.4,26.8 15.4,26 15.1,25.7 12.7,25.7 11.6,24.6 | v11,19.1 11,19.62 | 11,19.62 | 11,19.62 10.78,19.22 | v11,19.1 10.78,19.22 | 11,19.62 | 11,19.62 11.22,19.22 | v11,19.1 11.22,19.22 | 11,19.62 10.78,19.22 | 10.78,19.22 | v11,19.1 10.78,19.22 | 11,19.62 11.22,19.22 | v11,19.1 11.22,19.22 | 11,19.62 10.78,19.22 | v11,19.1 10.78,19.22 | 11,19.62 11.22,19.22 | v11,19.1 11.22,19.22
  Bottom 0.254: J2.10 10.47,19.1 | 10.47,19.1 v11,19.1 | 10.47,19.1 10.88,18.88 v11,19.1 | 10.47,19.1 10.88,19.32 v11,19.1
CMOS_TWD  (via drill 0.35)
  Top 0.203: R14.1
  Top 0.254: 13.68,26.4 11.6,26.4 10.1,24.9 10.1,19.7 9.2,18.8 9.2,18.52 | 13.68,26.4 v14.2,26.4 | v9.2,18 9.2,18.52 | R14.1 13.19,24.59 13.66,25.06 U5.5 16.36,25.06 16.6,25.3 16.6,26 16.57,26.03 | 16.57,26.03 v16.2,26.4 | 9.2,18.52 8.98,18.12 | 13.68,26.4 14.08,26.18 | 8.98,18.12 | 14.08,26.18 | 9.2,18.52 | 9.2,18.52 8.98,18.12 | v9.2,18 8.98,18.12 | 9.2,18.52 | 9.2,18.52 9.42,18.12 | 9.42,18.12 | 9.2,18.52 | 9.2,18.52 9.42,18.12 | v9.2,18 9.42,18.12 | 9.2,18.52 8.98,18.12 | 8.98,18.12 | 9.2,18.52 8.98,18.12 | v9.2,18 8.98,18.12 | 9.2,18.52 9.42,18.12 | 9.42,18.12 | v9.2,18 9.42,18.12 | 9.2,18.52 8.98,18.12 | 9.2,18.52 9.42,18.12 | 9.2,18.52 8.98,18.12 | v9.2,18 8.98,18.12 | 9.2,18.52 9.42,18.12 | v9.2,18 9.42,18.12 | 13.68,26.4 | 13.68,26.4 14.08,26.18 | v14.2,26.4 14.08,26.18 | 13.68,26.4 | 13.68,26.4 14.08,26.62 | 14.08,26.62 | 13.68,26.4 | 13.68,26.4 14.08,26.62 | v14.2,26.4 14.08,26.62 | 13.68,26.4 14.08,26.18 | 14.08,26.18 | 13.68,26.4 14.08,26.18 | v14.2,26.4 14.08,26.18 | 13.68,26.4 14.08,26.62 | 14.08,26.62 | v14.2,26.4 14.08,26.62 | 13.68,26.4 14.08,26.18 | 13.68,26.4 14.08,26.62 | 13.68,26.4 14.08,26.18 | v14.2,26.4 14.08,26.18 | 13.68,26.4 14.08,26.62 | v14.2,26.4 14.08,26.62 | 16.57,26.03 16.44,26.47 v16.2,26.4 | 16.57,26.03 16.13,26.16 v16.2,26.4
  Bottom 0.254: J2.9 2.9,19.1 2.6,18.8 2.6,17.8 3,17.4 8.6,17.4 8.83,17.63 | v14.2,26.4 14.72,26.4 | 14.72,26.4 15.68,26.4 | 15.68,26.4 v16.2,26.4 | 8.83,17.63 v9.2,18 | 14.72,26.4 | 14.72,26.4 14.32,26.62 | 14.32,26.62 | 15.68,26.4 | 15.68,26.4 16.08,26.18 | 15.68,26.4 16.08,26.62 | 16.08,26.62 | v16.2,26.4 16.08,26.62 | 8.83,17.63 9.27,17.76 v9.2,18 | 8.83,17.63 8.96,18.07 v9.2,18 | 14.72,26.4 | 14.72,26.4 14.32,26.62 | v14.2,26.4 14.32,26.62 | 14.72,26.4 | 14.72,26.4 14.32,26.18 | 14.32,26.18 | 14.72,26.4 | 14.72,26.4 14.32,26.18 | v14.2,26.4 14.32,26.18 | 14.72,26.4 14.32,26.18 | 14.32,26.18 | 14.72,26.4 14.32,26.62 | 14.32,26.62 | v14.2,26.4 14.32,26.62 | 14.72,26.4 14.32,26.18 | v14.2,26.4 14.32,26.18 | 14.72,26.4 14.32,26.62 | v14.2,26.4 14.32,26.62 | 14.72,26.4 14.32,26.18 | v14.2,26.4 14.32,26.18 | 15.68,26.4 | 15.68,26.4 16.08,26.18 | 16.08,26.18 | 15.68,26.4 | 15.68,26.4 16.08,26.18 | 16.08,26.18 | v16.2,26.4 16.08,26.18 | 15.68,26.4 16.08,26.62 | 15.68,26.4 16.08,26.18 | v16.2,26.4 16.08,26.18 | 15.68,26.4 16.08,26.62 | 16.08,26.62 | v16.2,26.4 16.08,26.62 | 15.68,26.4 16.08,26.18 | v16.2,26.4 16.08,26.18 | 15.68,26.4 16.08,26.62 | v16.2,26.4 16.08,26.62
GND  (via drill 0.35)
  Top 1.27: C4.NEG 2.64,14.24 3.4,15 6.82,15 C5.NEG
  other vias: 48.2,2.4 42,19 42,22.8 29.4,25.2 14.2,33.2 49.6,38.2 2.8,32.8 2.4,15.6 17.4,2 37.8,22.8 36.2,18.8 35.4,12.2 35,13.8 35.6,16.2 21.4,6.2 27,6.4 15,18.4 15.8,13.4
  pour Bottom: 0,42.4 55,42.4 55,0.2 0,0.2
  pour Top: 0.2,42.2 54.8,42.2 54.8,0.2 11.8,0.2 11.8,14.6 0.2,14.6
LED_FLASH1
  Bottom 0.254: J2.1 3.22,24.18 3,24.4 3,25.6 3.2,25.8 11,25.8 11.4,26.2 R16.1
LED_FLASH2
  Bottom 0.254: R17.1 6.81,26.81 6.4,26.4 3,26.4 2.4,25.8 2.4,23.2 2.69,22.91 J2.3
N$1
  Top 0.254: R7.2 23.53,32.63 24,33.1 T3.B
N$2
  Bottom 0.254: U2.4 47.65,12.45 47.8,12.6 53.2,12.6 53.6,12.2 53.6,8.6 52.73,7.72 U2.9
N$3
  Bottom 0.254: J3.4 6.86,35.49 6.86,33.53 R17.2
  Bottom 0.508: 6.86,35.49 7.13,36.06 | J3.4 7.13,36.06 | 6.86,35.49 | 6.86,35.49 6.59,36.06 | J3.4 6.59,36.06 | 6.86,35.49 7.13,36.06 | 7.13,36.06 | J3.4 7.13,36.06 | 6.86,35.49 6.59,36.06 | J3.4 6.59,36.06 | 6.86,35.49 7.13,36.06 | J3.4 7.13,36.06 | 6.86,35.49 6.59,36.06 | J3.4 6.59,36.06
N$4
  Top 0.305: T1.B 38.06,33.06 37.6,32.6 R3.2
N$5
  Top 0.305: R9.2 30.53,32.53 31,33 31,33.87 T4.B
N$6
  Top 0.406: U3.1 10.25,9.85 10.4,10 10.8,10 11.4,10.6 11.4,13.8 | C3.2 9.81,15.61 9.4,15.2 9.4,14.8 10,14.2 | 10,14.2 10,13.26 | 10,13.26 R1.1 10,13.2 10,13.26 | 10,14.2 11,14.2 11.4,13.8 | R2.2 13.19,14.01 13,14.2 11.8,14.2 11.4,13.8
N$7  (via drill 0.35)
  Top 0.254: v50.2,4 50.57,4.37 | 50.57,4.37 53.8,7.6 53.8,24.6 53,25.4 46.52,25.4 | 46.52,25.4 v46,25.4 | R3.1 37.61,25.99 38.2,25.4 45.48,25.4 | 45.48,25.4 v46,25.4 | 45.48,25.4 45.88,25.18 | 46.52,25.4 | 46.52,25.4 46.12,25.62 | 46.12,25.62 | 45.88,25.18 | 50.57,4.37 50.13,4.24 v50.2,4 | 50.57,4.37 50.44,3.93 v50.2,4 | 46.52,25.4 | 46.52,25.4 46.12,25.62 | v46,25.4 46.12,25.62 | 46.52,25.4 | 46.52,25.4 46.12,25.18 | 46.12,25.18 | 46.52,25.4 | 46.52,25.4 46.12,25.18 | v46,25.4 46.12,25.18 | 45.48,25.4 | 45.48,25.4 45.88,25.18 | v46,25.4 45.88,25.18 | 45.48,25.4 | 45.48,25.4 45.88,25.62 | 45.88,25.62 | 45.48,25.4 | 45.48,25.4 45.88,25.62 | v46,25.4 45.88,25.62 | 46.52,25.4 46.12,25.18 | 46.12,25.18 | 46.52,25.4 46.12,25.62 | 46.12,25.62 | v46,25.4 46.12,25.62 | 46.52,25.4 46.12,25.18 | v46,25.4 46.12,25.18 | 46.52,25.4 46.12,25.62 | v46,25.4 46.12,25.62 | 46.52,25.4 46.12,25.18 | v46,25.4 46.12,25.18 | 45.48,25.4 45.88,25.18 | 45.88,25.18 | 45.48,25.4 45.88,25.18 | v46,25.4 45.88,25.18 | 45.48,25.4 45.88,25.62 | 45.88,25.62 | v46,25.4 45.88,25.62 | 45.48,25.4 45.88,25.18 | 45.48,25.4 45.88,25.62 | 45.48,25.4 45.88,25.18 | v46,25.4 45.88,25.18 | 45.48,25.4 45.88,25.62 | v46,25.4 45.88,25.62
  Bottom 0.254: U2.11 50.19,4.53 | 50.19,4.53 50.19,4.01 v50.2,4 | U1.11 46.13,24.89 | 46.13,24.89 46.13,25.27 v46,25.4 | 50.19,4.53 49.98,4.11 v50.2,4 | 50.19,4.53 50.41,4.12 v50.2,4 | 46.13,24.89 46.24,25.34 v46,25.4 | 46.13,24.89 45.82,25.23 v46,25.4
N$8
  Bottom 0.254: J3.1 11.36,35.49 11.36,33.48 R16.2
  Bottom 0.508: 11.36,35.49 11.63,36.06 | J3.1 11.63,36.06 | 11.36,35.49 | 11.36,35.49 11.09,36.06 | J3.1 11.09,36.06 | 11.36,35.49 11.63,36.06 | 11.63,36.06 | J3.1 11.63,36.06 | 11.36,35.49 11.09,36.06 | J3.1 11.09,36.06 | 11.36,35.49 11.63,36.06 | J3.1 11.63,36.06 | 11.36,35.49 11.09,36.06 | J3.1 11.09,36.06
N$9
  Top 0.254: R5.2 16.53,32.63 17,33.1 17,33.91 T2.B
N$11
  Top 0.254: R15.1 15,21.61 | 15,21.61 15.76,21.61 C20.1 | U5.7 16.64,23.76 16.8,23.6 16.8,23.3 16.6,23.1 16.5,23.1 | U5.8 16.5,23.1 | 16.5,23.1 16.8,22.8 16.8,22.6 16.6,22.4 15.2,22.4 15,22.2 15,21.61
VDD_3  (via drill 0.35)
  Top 0.254: 8.03,2.2 U3.4 | 15.12,19.4 18.8,19.4 20.8,21.4 20.8,23 | 15.12,19.4 v14.6,19.4 | 8,8.57 U3.2 | 7,11.44 C5.POS | U5.2 20.64,23.76 20.8,23.6 20.8,23 | 15.12,19.4 | 15.12,19.4 14.72,19.62 | 14.72,19.62 | 15.12,19.4 | 15.12,19.4 14.72,19.62 | v14.6,19.4 14.72,19.62 | 15.12,19.4 | 15.12,19.4 14.72,19.18 | 14.72,19.18 | 15.12,19.4 | 15.12,19.4 14.72,19.18 | v14.6,19.4 14.72,19.18 | 15.12,19.4 14.72,19.18 | 14.72,19.18 | 15.12,19.4 14.72,19.62 | 14.72,19.62 | v14.6,19.4 14.72,19.62 | 15.12,19.4 14.72,19.18 | v14.6,19.4 14.72,19.18 | 15.12,19.4 14.72,19.62 | v14.6,19.4 14.72,19.62 | 15.12,19.4 14.72,19.18 | v14.6,19.4 14.72,19.18 | R12.2 22.35,23 20.8,23 | R11.2 25.6,23.13 25.6,22.4 26,22 26.8,22 27.1,22.3 v27.1,23.6
  Top 0.305: T4.C 32.02,38.18 31.77,38.43 | 31.77,38.43 v31.4,38.8 | 8.6,12.6 8.6,16 8,16.6 2,16.6 1.4,17.2 1.4,35.4 4.8,38.8 18,38.8 | v31.4,38.8 30.88,38.8 | 30.88,38.8 25,38.8 | 25,38.8 18,38.8 | T2.C 17.98,38.78 18,38.8 | T3.C 24.95,38.75 25,38.8 | 30.88,38.8 31.31,38.6 | 31.31,38.6 | 31.31,39 | 30.88,38.8 | 30.88,38.8 | 30.88,38.8 31.31,39 | 30.88,38.8 31.31,38.6 | v31.4,38.8 31.31,38.6 | 30.88,38.8 | 30.88,38.8 31.31,39 | 31.31,39 | 31.77,38.43 31.61,38.88 v31.4,38.8 | 31.77,38.43 31.32,38.59 v31.4,38.8 | 30.88,38.8 31.31,39 | 30.88,38.8 31.31,38.6 | 30.88,38.8 31.31,39 | 31.31,39 | 30.88,38.8 31.31,38.6 | 31.31,38.6 | v31.4,38.8 31.31,38.6 | 30.88,38.8 31.31,39 | v31.4,38.8 31.31,39 | 30.88,38.8 31.31,38.6 | v31.4,38.8 31.31,38.6 | 30.88,38.8 31.31,39 | v31.4,38.8 31.31,39
  Top 0.308: 8.6,12.6 8.6,10.6 | 8.6,10.6 8,10 | 8,10 8,8.57 | 8,10 7.4,10 7,10.4 7,11.44 | R1.2 9.97,10.77 9.8,10.6 8.6,10.6
  Top 0.406: 11,2.6 13.47,2.6 | 13.47,2.6 v14,2.6 | 13.94,2.44 | 13.94,2.76 | 13.47,2.6 13.94,2.44 | 13.47,2.6 13.94,2.76 | 13.47,2.6 13.94,2.44 | v14,2.6 13.94,2.44 | 13.47,2.6 | 13.47,2.6 13.94,2.76 | v14,2.6 13.94,2.76 | 13.47,2.6 13.94,2.44 | 13.47,2.6 13.94,2.76 | 13.94,2.76 | 13.47,2.6 13.94,2.44 | 13.94,2.44 | v14,2.6 13.94,2.44 | 13.47,2.6 13.94,2.76 | v14,2.6 13.94,2.76 | 13.47,2.6 13.94,2.44 | v14,2.6 13.94,2.44 | 13.47,2.6 13.94,2.76 | v14,2.6 13.94,2.76
  Top 0.61: 17.9,36.22 T2.C
  Top 1.27: 7.99,8.51 U3.2
  Bottom 0.254: 40.2,12.8 40.2,17.6 | 40.2,17.6 40.2,21 | 40.2,21 40.2,30.5 31.1,30.5 | U4.31 35.2,19.4 | U4.41 37.5,11.4 | U4.32 34.4,18.6 35.2,19.4 | U4.2 26.3,5.9 26.6,5.6 27.2,5.6 | C13.1 28,5.05 28,5.8 | U4.47 28.7,6.5 28,5.8 | 35.2,19.4 36.8,21 37.5,21 | 37.5,21 39,21 | 39,21 40.2,21 | C14.1 37.5,21 | C15.1 39,21 | U4.14 20.6,16.2 19.4,17.6 14,17.6 | U4.35 34,16.2 35.2,17.6 40.2,17.6 | U4.37 35.3,14.6 37.1,12.8 40.2,12.8 | 40.2,11.4 39,11.4 | 39,11.4 37.5,11.4 | C11.1 39,11.4 | C10.1 37.5,11.4 | v14,2.6 14,3.12 | 14,3.12 14,11.4 | 14,11.4 14,17.6 | U4.29 31.1,30.5 | U4.8 17.8,11.4 | 17.8,11.4 16.3,11.4 | 16.3,11.4 14,11.4 | C9.1 17.8,11.4 | C8.1 16.3,11.4 | U4.18 17.8,19.4 | 17.8,19.4 16.5,19.4 | 16.5,19.4 15.12,19.4 | 15.12,19.4 v14.6,19.4 | v14.6,19.4 14.4,19.4 14.14,19.14 | 14.14,19.14 14,19 14,17.6 | C7.1 17.8,19.4 | C6.1 16.5,19.4 | U4.24 v27.1,23.6 27.1,24.8 | 27.1,24.8 27.1,26.3 | 26.35,26.2 C16.1 27.1,26.3 | C17.1 27.1,24.8 | C1.1 53.21,21.59 52.8,22 52,22 | U1.20 51.87,22.14 52,22 | U2.16 43.84,4.17 C2.1 40.59,3.81 40.2,4.2 40.2,11.4 | 40.2,11.4 40.2,12.8 | 27.2,3.5 27.2,0.8 27,0.6 14.6,0.6 14,1.2 14,2.08 | 14,2.08 v14,2.6 | 40.2,21 43,21 43.8,20.2 51.4,20.2 52,20.8 52,22 | 27.1,26.3 27.1,29.6 28,30.5 31.1,30.5 | 28,5.8 27.4,5.8 27.2,5.6 | 14,3.12 13.78,2.72 | 13.78,2.72 | 14,2.08 | 14,2.08 14.22,2.48 | 14.22,2.48 | 15.12,19.4 | 15.12,19.4 14.72,19.62 | 14.72,19.62 | 14,3.12 | 14,3.12 13.78,2.72 | v14,2.6 13.78,2.72 | 14,3.12 | 14,3.12 14.22,2.72 | 14.22,2.72 | 14,3.12 | 14,3.12 14.22,2.72 | v14,2.6 14.22,2.72 | 14,2.08 | 14,2.08 14.22,2.48 | v14,2.6 14.22,2.48 | 14,2.08 | 14,2.08 13.78,2.48 | 13.78,2.48 | 14,2.08 | 14,2.08 13.78,2.48 | v14,2.6 13.78,2.48 | 14,3.12 13.78,2.72 | 13.78,2.72 | 14,3.12 13.78,2.72 | v14,2.6 13.78,2.72
  Bottom 0.254: 14,3.12 14.22,2.72 | 14.22,2.72 | v14,2.6 14.22,2.72 | 14,3.12 13.78,2.72 | 14,3.12 14.22,2.72 | 14,3.12 13.78,2.72 | v14,2.6 13.78,2.72 | 14,3.12 14.22,2.72 | v14,2.6 14.22,2.72 | 14,2.08 13.78,2.48 | 13.78,2.48 | 14,2.08 14.22,2.48 | 14.22,2.48 | v14,2.6 14.22,2.48 | 14,2.08 13.78,2.48 | v14,2.6 13.78,2.48 | 14,2.08 14.22,2.48 | v14,2.6 14.22,2.48 | 14,2.08 13.78,2.48 | v14,2.6 13.78,2.48 | 15.12,19.4 | 15.12,19.4 14.72,19.62 | v14.6,19.4 14.72,19.62 | 15.12,19.4 | 15.12,19.4 14.72,19.18 | 14.72,19.18 | 15.12,19.4 | 15.12,19.4 14.72,19.18 | v14.6,19.4 14.72,19.18 | 15.12,19.4 14.72,19.18 | 14.72,19.18 | 15.12,19.4 14.72,19.62 | 14.72,19.62 | v14.6,19.4 14.72,19.62 | 15.12,19.4 14.72,19.18 | v14.6,19.4 14.72,19.18 | 15.12,19.4 14.72,19.62 | v14.6,19.4 14.72,19.62 | 15.12,19.4 14.72,19.18 | v14.6,19.4 14.72,19.18 | 14.14,19.14 14.61,19.15 v14.6,19.4 | 14.14,19.14 14.39,19.53 v14.6,19.4 | C12.1 27.2,3.5 | 27.2,3.5 27.2,5.6
  Bottom 0.305: 40.2,30.5 40.2,38.2 39.6,38.8 31.93,38.8 | 31.93,38.8 v31.4,38.8 | 31.93,38.8 31.49,38.6 | 31.49,39 | 31.49,38.6 | 31.93,38.8 31.49,39 | 31.93,38.8 | 31.93,38.8 | 31.93,38.8 31.49,39 | 31.49,39 | 31.93,38.8 | 31.93,38.8 31.49,38.6 | v31.4,38.8 31.49,38.6 | 31.93,38.8 31.49,38.6 | 31.49,38.6 | 31.93,38.8 31.49,39 | 31.49,39 | 31.93,38.8 31.49,38.6 | v31.4,38.8 31.49,38.6 | 31.93,38.8 31.49,39 | v31.4,38.8 31.49,39 | 31.93,38.8 31.49,38.6 | v31.4,38.8 31.49,38.6
  pour Top (isolate 0.254): 5,0.4 5,5.6 7.2,5.6 7.2,9.4 8.8,9.4 8.8,5.6 11,5.6 11,0.4
VDD_5  (via drill 0.35)
  Top 0.406: 1,8.8 0.8,9 0.8,36 5.4,40.6 47.8,40.6 48.2,40.2 48.2,36.2 48.54,35.86 52.88,35.86 | v53.4,35.8 53.24,35.86 | v53.4,35.8 53.56,35.86 v53.4,35.8 | v53.4,35.8 53.24,35.86 | 53.24,35.86 52.88,35.86 | 52.88,35.86 53.33,35.65 v53.4,35.8 | 52.88,35.86 53.36,35.97 v53.4,35.8
  Bottom 0.406: J1.P1 52.92,33.33 53.4,33.8 53.4,35.27 | 53.4,35.27 v53.4,35.8 | 53.24,35.74 | 53.56,35.74 | 53.4,35.27 53.56,35.74 | 53.4,35.27 | 53.4,35.27 53.24,35.74 | 53.4,35.27 53.56,35.74 | v53.4,35.8 53.56,35.74 | 53.4,35.27 53.24,35.74 | v53.4,35.8 53.24,35.74 | 53.24,35.74 | 53.4,35.27 53.56,35.74 | 53.4,35.27 53.24,35.74 | 53.4,35.27 53.24,35.74 | v53.4,35.8 53.24,35.74 | 53.4,35.27 53.56,35.74 | v53.4,35.8 53.56,35.74 | 53.4,35.27 53.24,35.74 | v53.4,35.8 53.24,35.74
  pour Top (isolate 0.254): 6.4,9.2 6.4,7.4 0.6,7.4 0.6,10.4 5.6,10.4 5.6,9.2
VDD_33  (via drill 0.35)
  Top 0.203: 13.17,22.72 R14.2 | R13.2
  Top 0.254: 39,37.2 39.4,37.6 45.6,37.6 46.8,36.4 46.8,27.52 | T1.C 39,37.2 | v46.8,27 46.8,27.52 | R13.2 13.17,22.72 | R15.2 12,21.61 | 12,21.61 11.89,21.61 11.5,22 R13.2 | 39,37.2 38.6,37.6 37.73,37.6 | 37.73,37.6 v37.2,37.6 | v5.4,30 4.88,30 | 4.88,30 2.6,30 2,29.4 2,17.6 2.5,17.1 10.7,17.1 11.8,18.2 11.8,21.41 12,21.61 | 46.8,27.52 46.58,27.12 | 4.88,30 5.28,29.78 | 46.58,27.12 | 37.73,37.6 | 37.73,37.6 37.32,37.82 | 37.32,37.82 | 5.28,29.78 | 46.8,27.52 | 46.8,27.52 46.58,27.12 | v46.8,27 46.58,27.12 | 46.8,27.52 | 46.8,27.52 47.02,27.12 | 47.02,27.12 | 46.8,27.52 | 46.8,27.52 47.02,27.12 | v46.8,27 47.02,27.12 | 46.8,27.52 46.58,27.12 | 46.58,27.12 | 46.8,27.52 46.58,27.12 | v46.8,27 46.58,27.12 | 46.8,27.52 47.02,27.12 | 47.02,27.12 | v46.8,27 47.02,27.12 | 46.8,27.52 46.58,27.12 | 46.8,27.52 47.02,27.12 | 46.8,27.52 46.58,27.12 | v46.8,27 46.58,27.12 | 46.8,27.52 47.02,27.12 | v46.8,27 47.02,27.12 | 37.73,37.6 | 37.73,37.6 37.32,37.82 | v37.2,37.6 37.32,37.82 | 37.73,37.6 | 37.73,37.6 37.32,37.38 | 37.32,37.38 | 37.73,37.6 | 37.73,37.6 37.32,37.38 | v37.2,37.6 37.32,37.38 | 37.73,37.6 37.32,37.38 | 37.32,37.38 | 37.73,37.6 37.32,37.82 | 37.32,37.82 | v37.2,37.6 37.32,37.82 | 37.73,37.6 37.32,37.38 | v37.2,37.6 37.32,37.38 | 37.73,37.6 37.32,37.82 | v37.2,37.6 37.32,37.82 | 37.73,37.6 37.32,37.38 | v37.2,37.6 37.32,37.38 | 4.88,30 | 4.88,30 5.28,29.78 | v5.4,30 5.28,29.78 | 4.88,30 | 4.88,30 5.28,30.22 | 5.28,30.22 | 4.88,30 | 4.88,30 5.28,30.22 | v5.4,30 5.28,30.22 | 4.88,30 5.28,29.78 | 5.28,29.78 | 4.88,30 5.28,29.78 | v5.4,30 5.28,29.78 | 4.88,30 5.28,30.22 | 5.28,30.22 | v5.4,30 5.28,30.22 | 4.88,30 5.28,29.78 | 4.88,30 5.28,30.22 | 4.88,30 5.28,29.78 | v5.4,30 5.28,29.78 | 4.88,30 5.28,30.22 | v5.4,30 5.28,30.22
  Bottom 0.254: J1.P12 47.32,26.98 | 47.32,26.98 46.83,26.98 v46.8,27 | v37.2,37.6 36.67,37.6 | 36.67,37.6 6,37.6 5.4,37 5.4,30.52 | 5.4,30.52 v5.4,30 | 36.67,37.6 37.08,37.38 | 5.4,30.52 5.18,30.12 | 37.08,37.38 | 5.18,30.12 | 47.32,26.98 46.93,27.21 v46.8,27 | 47.32,26.98 46.91,26.78 v46.8,27 | 36.67,37.6 | 36.67,37.6 37.08,37.38 | v37.2,37.6 37.08,37.38 | 36.67,37.6 | 36.67,37.6 37.08,37.82 | 37.08,37.82 | 36.67,37.6 | 36.67,37.6 37.08,37.82 | v37.2,37.6 37.08,37.82 | 36.67,37.6 37.08,37.38 | 37.08,37.38 | 36.67,37.6 37.08,37.38 | v37.2,37.6 37.08,37.38 | 36.67,37.6 37.08,37.82 | 37.08,37.82 | v37.2,37.6 37.08,37.82 | 36.67,37.6 37.08,37.38 | 36.67,37.6 37.08,37.82 | 36.67,37.6 37.08,37.38 | v37.2,37.6 37.08,37.38 | 36.67,37.6 37.08,37.82 | v37.2,37.6 37.08,37.82 | 5.4,30.52 | 5.4,30.52 5.18,30.12 | v5.4,30 5.18,30.12 | 5.4,30.52 | 5.4,30.52 5.62,30.12 | 5.62,30.12 | 5.4,30.52 | 5.4,30.52 5.62,30.12 | v5.4,30 5.62,30.12 | 5.4,30.52 5.18,30.12 | 5.18,30.12 | 5.4,30.52 5.18,30.12 | v5.4,30 5.18,30.12 | 5.4,30.52 5.62,30.12 | 5.62,30.12 | v5.4,30 5.62,30.12 | 5.4,30.52 5.18,30.12 | 5.4,30.52 5.62,30.12 | 5.4,30.52 5.18,30.12 | v5.4,30 5.18,30.12 | 5.4,30.52 5.62,30.12 | v5.4,30 5.62,30.12

## Text on the board
bPlace: TFXXi | SOC